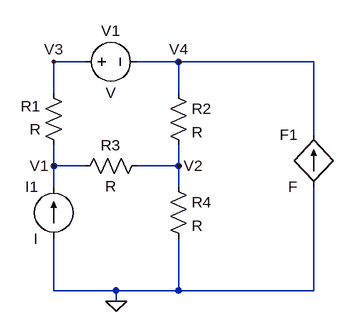
[diagram p0: schematic MeshCurrentAnalysis.asc]
MeshCurrentAnalysis.asc, the LTspice schematic file:
Version 4
SHEET 1 880 680
WIRE 48 64 0 64
WIRE 192 64 128 64
WIRE 400 64 192 64
WIRE 0 112 0 64
WIRE 192 112 192 64
WIRE 400 176 400 64
WIRE 0 224 0 192
WIRE 48 224 0 224
WIRE 192 224 192 192
WIRE 192 224 128 224
WIRE 0 256 0 224
WIRE 192 256 192 224
WIRE 0 416 0 336
WIRE 96 416 0 416
WIRE 192 416 192 336
WIRE 192 416 96 416
WIRE 400 416 400 256
WIRE 400 416 192 416
WIRE 96 432 96 416
FLAG 96 432 0
FLAG 0 64 V3
FLAG 192 64 V4
FLAG 192 224 V2
FLAG 0 224 V1
SYMBOL voltage 32 64 R270
WINDOW 0 32 56 VTop 2
WINDOW 3 -32 56 VBottom 2
SYMATTR InstName V1
SYMBOL res 16 208 R180
WINDOW 0 36 76 Left 2
WINDOW 3 36 40 Left 2
SYMATTR InstName R1
SYMBOL res 176 96 R0
SYMATTR InstName R2
SYMBOL res 144 208 R90
WINDOW 0 0 56 VBottom 2
WINDOW 3 32 56 VTop 2
SYMATTR InstName R3
SYMBOL res 176 240 R0
SYMATTR InstName R4
SYMBOL current 0 336 R180
WINDOW 0 24 80 Left 2
WINDOW 3 24 0 Left 2
SYMATTR InstName I1
SYMBOL f 400 256 R180
WINDOW 0 24 80 Left 2
WINDOW 3 24 0 Left 2
SYMATTR InstName F1

The netlist it stands for:
* MeshCurrentAnalysis.asc
V1 V3 V4 V
R1 V1 V3 R
R2 V4 V2 R
R3 V2 V1 R
R4 V2 0 R
I1 0 V1 I
F1 0 V4 F
.backanno
.end